# Altium schematic sheet watch.SchDoc
size A3
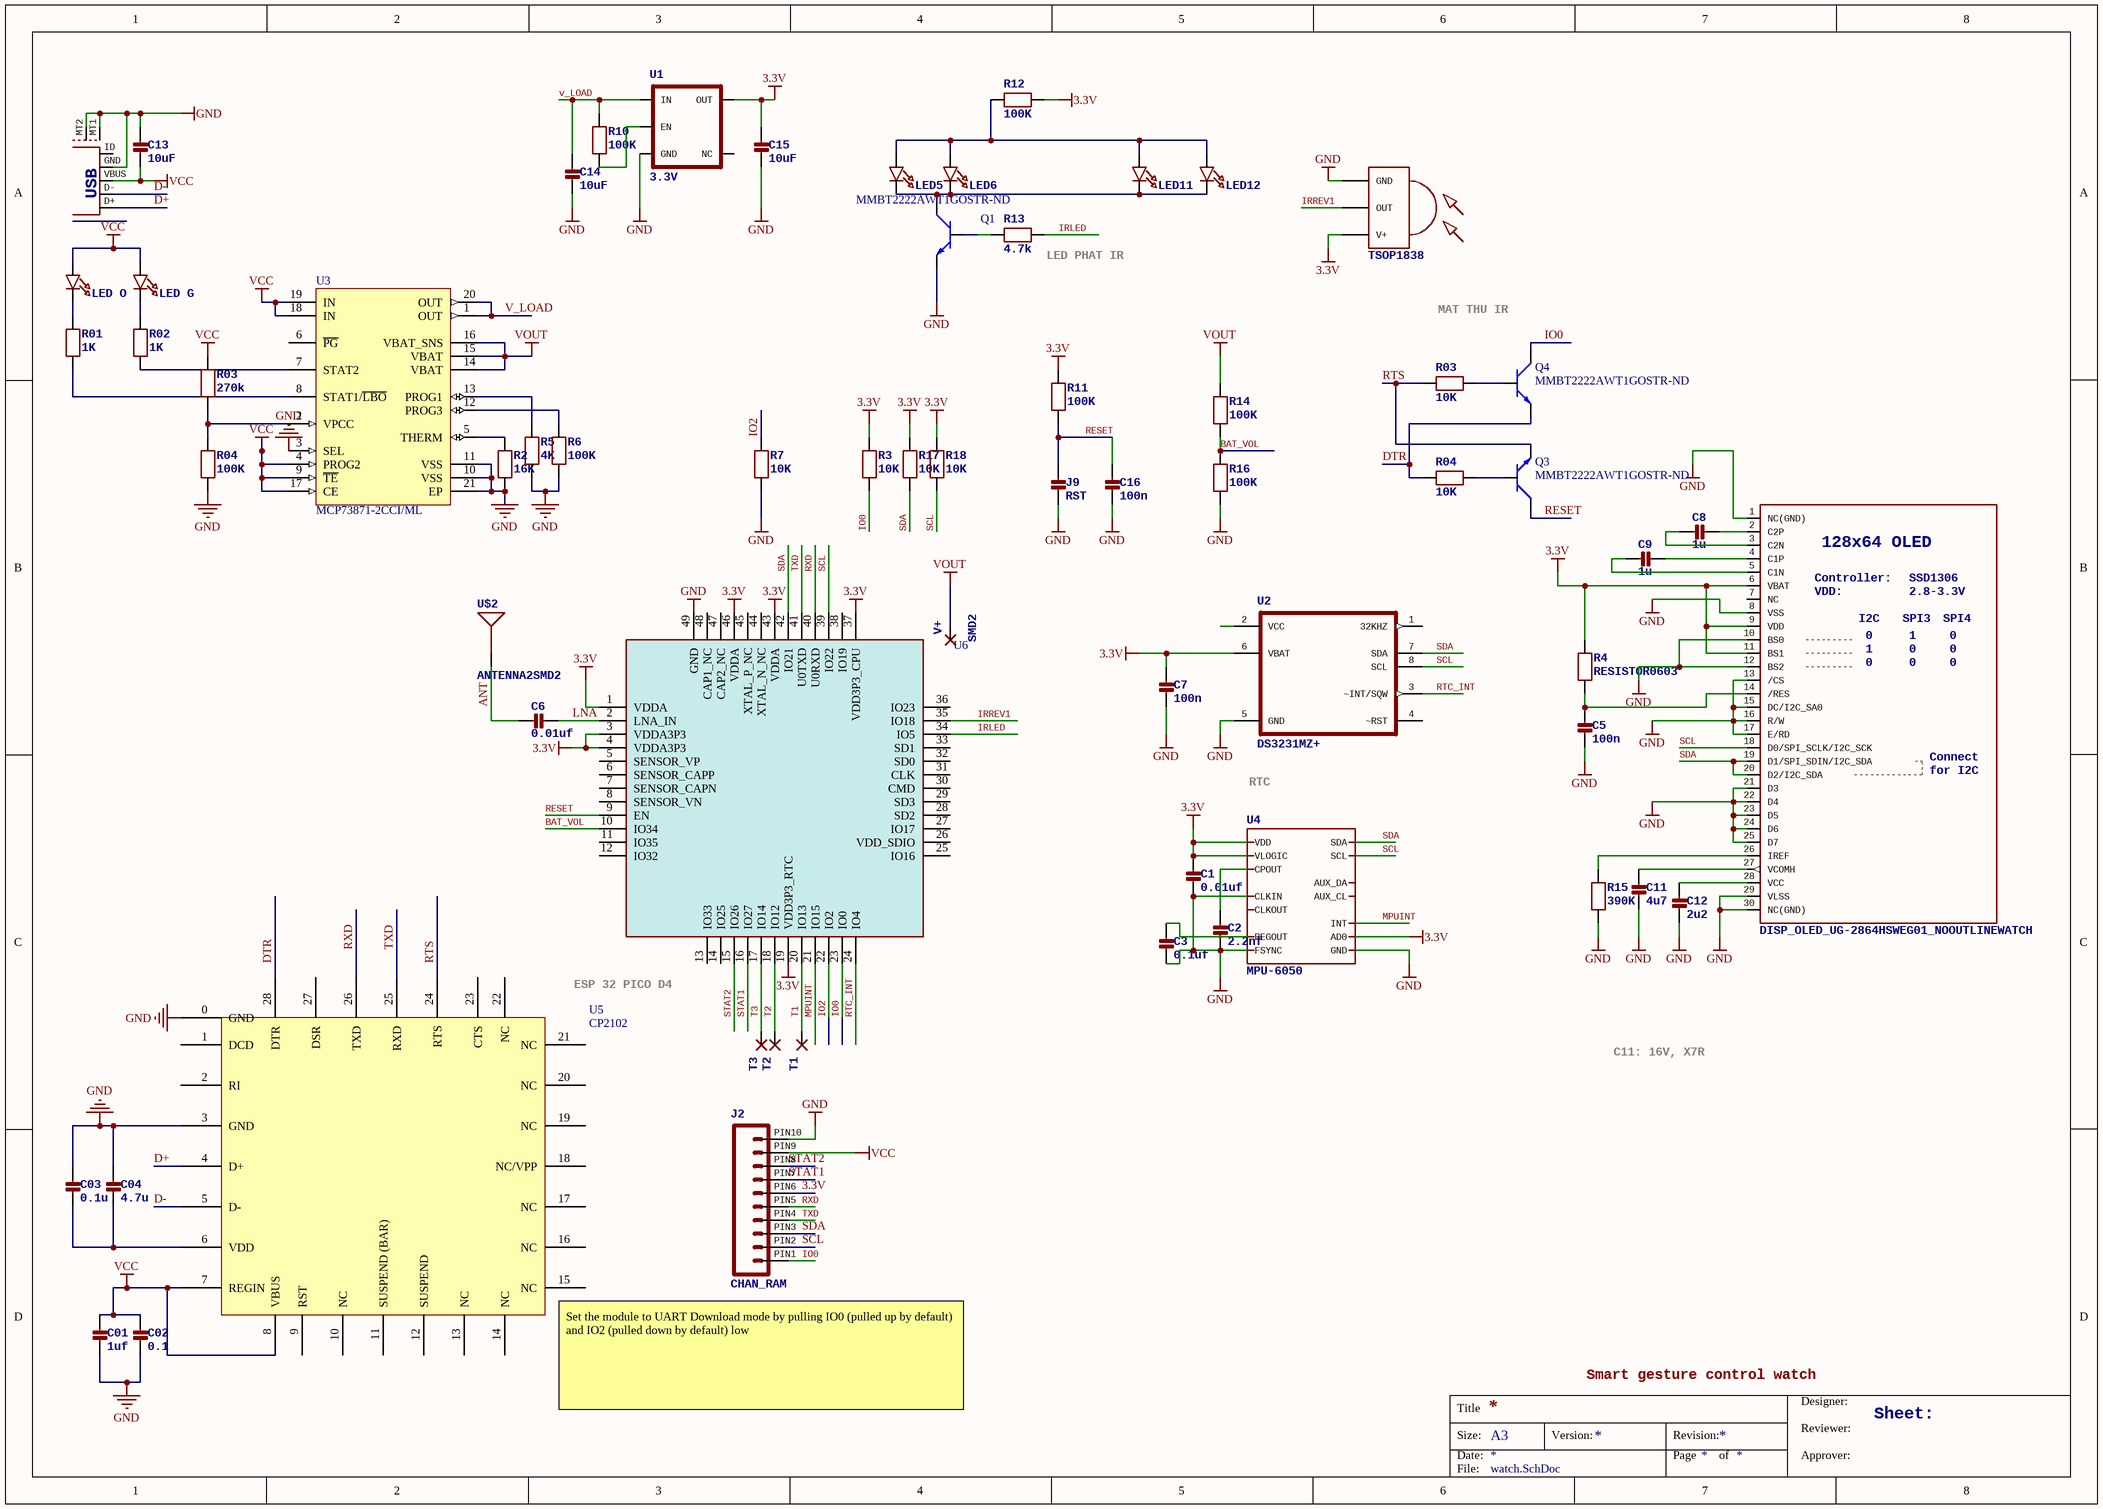
[diagram p0: watch.SchDoc]

## Parts
(Parts that share a designator on the sheet are numbered #1, #2 ... from top to bottom, then left to right.)
C1  0.01uf  [0603]
C01  1uf  [0603]
C2  2.2nf  [0603]
C02  0.1  [0603]
C3  0.1uf  [0603]
C03  0.1u  [0603]
C04  4.7u  [0603]
C5  100n  [0603]
C6  0.01uf  [0603]
C7  100n  [0603]
C8  1u  [0603]
C9  1u  [0603]
C11  4u7  [0603]
C12  2u2  [0603]
C13  10uF  [0603]
C14  10uF  [0603]
C15  10uF  [0603]
C16  100n  [0603]
J2  CHAN_RAM  [CHAN_RAM]
J9  RST  [0603]
LED5  LED0805  [CHIPLED_0805]  (value not drawn)
LED6  LED0805  [CHIPLED_0805]  (value not drawn)
LED11  LED0805  [CHIPLED_0805]  (value not drawn)
LED12  LED0805  [CHIPLED_0805]  (value not drawn)
LED_G  LED0805  [CHIPLED_0805]  (value not drawn)
LED_O  LED0805  [CHIPLED_0805]  (value not drawn)
OLED1  DISP_OLED_UG-2864HSWEG01_NOOUTLINEWATCH  128x64OLED: 128x64 OLED  forI2C: for I2C  Controller: Controller:  VDD: VDD:  [UG-2864HSWEG01_1.3_WRAPAROUND_WATCH]
Q1  Supplier Part Number 1: MMBT2222AWT1GOSTR-ND  [SOT-323]  (hidden comment: MMBT2222A)
Q3  Supplier Part Number 1: MMBT2222AWT1GOSTR-ND  [SOT-323]  (hidden comment: MMBT2222A)
Q4  Supplier Part Number 1: MMBT2222AWT1GOSTR-ND  [SOT-323]  (hidden comment: MMBT2222A)
R01  1K  [0603]
R2  16K  [0603]
R02  1K  [0603]
R3  10K  [0603]
R03#1  270k  [0603]
R03#2  10K  [0603]
R4  RESISTOR0603  [0603]
R04#1  100K  [0603]
R04#2  10K  [0603]
R5  4K  [0603]
R6  100K  [0603]
R7  10K  [0603]
R10  100K  [0603]
R11  100K  [0603]
R12  100K  [0603]
R13  4.7k  [0603]
R14  100K  [0603]
R15  390K  [0603]
R16  100K  [0603]
R17  10K  [0603]
R18  10K  [0603]
T1  SMD2  [SMD1,27-2,54]  (value not drawn)
T2  SMD2  [SMD1,27-2,54]  (value not drawn)
T3  SMD2  [SMD1,27-2,54]  (value not drawn)
U1  3.3V  [SOT23-5]
U2  DS3231MZ+  [SOIC8_150MIL_SMPAD]
U3  MCP73871-2CCI/ML  [QFN-ML20_N]
U4  MPU-6050  [QFN.24.4X4]
U5  CP2102  [CP2102]
U6  ESP32-PICO-D4  [PQFN50P700X700X100_HS-49N]  (value not drawn)
U$2  ANTENNA2SMD2  [ANTENNA-CHIP3]
U$4  TSOP1838  [TSOP18XX]
USB1  USB-MICROBLARGEPAD  [USB-MICROB_LARGEPAD]  (value not drawn)
V+  SMD2  [SMD1,27-2,54]

## Nets
3.3V: C1.2(P$2) C7.1(P$1) C15.1(P$1) J2.PIN6 OLED1.6(VBAT) OLED1.9(VDD) OLED1.11(BS1) R3.1 R4.2 R11.2 R12.1 R17.1 R18.1 U1.5(OUT) U2.6(VBAT) U4.8(VLOGIC) U4.9(AD0) U4.13(VDD) U6.1(VDDA) U6.3(VDDA3P3) U6.4(VDDA3P3) U6.19(VDD3P3_RTC) U6.37(VDD3P3_CPU) U6.43(VDDA) U6.46(VDDA) U$4.VCC(V+)
GND: C1.1(P$1) C01.2(P$2) C2.2(P$2) C02.2(P$2) C3.1(P$1) C03.1(P$1) C04.1(P$1) C5.2(P$2) C7.2(P$2) C11.2(P$2) C12.2(P$2) C13.1(P$1) C14.2(P$2) C15.2(P$2) C16.2(P$2) J2.PIN10 J9.2(P$2) OLED1.1(NC(GND)) OLED1.8(VSS) OLED1.10(BS0) OLED1.12(BS2) OLED1.13(/CS) OLED1.15(DC/I2C_SA0) OLED1.16(R/W) OLED1.17(E/RD) OLED1.21(D3) OLED1.22(D4) OLED1.23(D5) OLED1.24(D6) OLED1.25(D7) OLED1.29(VLSS) OLED1.30(NC(GND)) Q1.2(E) R2.2 R04#1.2 R5.2 R6.2 R7.2 R15.1 R16.2 U1.2(GND) U2.5(GND) U3.3(SEL) U3.10(VSS) U3.11(VSS) U3.21(EP) U4.1(CLKIN) U4.11(FSYNC) U4.18(GND) U5.0(GND) U5.3(GND) U6.49(GND) U$4.GND USB1.GND USB1.MT1(SHEILD1) USB1.MT2(SHEILD2)
VCC: C01.1(P$1) C02.1(P$1) C13.2(P$2) J2.PIN9 LED_G.1(A) LED_O.1(A) R03#1.1 U3.4(PROG2) U3.9(~{TE}) U3.17(CE) U3.18(IN) U3.19(IN) U5.7(REGIN) U5.8(VBUS) USB1.VBUS
VOUT: R14.1 U3.14(VBAT) U3.15(VBAT) U3.16(VBAT_SNS) V+.1(P)
ANT: C6.1(P$1) U$2.FEED(SIGNAL)
BAT_VOL: R14.2 R16.1 U6.10(IO34)
D+: U5.4(D+) USB1.D+
D-: U5.5(D-) USB1.D-
DTR: Q4.2(E) R04#2.1 U5.28(DTR)
IO0: J2.PIN1 Q4.3(C) R3.2 U6.23(IO0)
IO2: R7.1 U6.22(IO2)
IRLED: R13.1 U6.34(IO5)
IRREV1: U6.35(IO18) U$4.OUT
LNA: C6.2(P$2) U6.2(LNA_IN)
MPUINT: U4.12(INT) U6.21(IO15)
RESET: C16.1(P$1) J9.1(P$1) Q3.3(C) R11.1 U6.9(EN)
RTC_INT: U2.3(~INT/SQW) U6.24(IO4)
RTS: Q3.2(E) R03#2.2 U5.24(RTS)
RXD: J2.PIN5 U5.26(TXD) U6.40(U0RXD)
SCL: J2.PIN2 OLED1.18(D0/SPI_SCLK/I2C_SCK) R18.2 U2.8(SCL) U4.23(SCL) U6.39(IO22)
SDA: J2.PIN3 OLED1.19(D1/SPI_SDIN/I2C_SDA) OLED1.20(D2/I2C_SDA) R17.2 U2.7(SDA) U4.24(SDA) U6.42(IO21)
STAT1: J2.PIN7 U6.16(IO27)
STAT2: J2.PIN8 U6.15(IO26)
T1: T1.1(P) U6.20(IO13)
T2: T2.1(P) U6.18(IO12)
T3: T3.1(P) U6.17(IO14)
TXD: J2.PIN4 U5.25(RXD) U6.41(U0TXD)
v_LOAD: C14.1(P$1) R10.2 U1.1(IN) U3.1(OUT) U3.20(OUT)
NetC2_1: C2.1(P$1) U4.20(CPOUT)
NetC3_2: C3.2(P$2) U4.10(REGOUT)
NetC03_2: C03.2(P$2) C04.2(P$2) U5.6(VDD)
NetC5_1: C5.1(P$1) OLED1.14(/RES) R4.1
NetC8_1: C8.1(P$1) OLED1.3(C2N)
NetC8_2: C8.2(P$2) OLED1.2(C2P)
NetC9_1: C9.1(P$1) OLED1.5(C1N)
NetC9_2: C9.2(P$2) OLED1.4(C1P)
NetC11_1: C11.1(P$1) OLED1.27(VCOMH)
NetC12_1: C12.1(P$1) OLED1.28(VCC)
NetLED5_1: LED5.1(A) LED6.1(A) LED11.1(A) LED12.1(A) R12.2
NetLED5_2: LED5.2(C) LED6.2(C) LED11.2(C) LED12.2(C) Q1.3(C)
NetLED_G_2: LED_G.2(C) R02.1
NetLED_O_2: LED_O.2(C) R01.1
NetOLED1_26: OLED1.26(IREF) R15.2
NetQ1_1: Q1.1(B) R13.2
NetQ3_1: Q3.1(B) R04#2.2
NetQ4_1: Q4.1(B) R03#2.1
NetR01_2: R01.2 U3.8(STAT1/~{LBO})
NetR2_1: R2.1 U3.5(THERM)
NetR02_2: R02.2 U3.7(STAT2)
NetR03#1_2: R03#1.2 R04#1.1 U3.2(VPCC)
NetR5_1: R5.1 U3.13(PROG1)
NetR6_1: R6.1 U3.12(PROG3)
NetR10_1: R10.1 U1.3(EN)

Not connected (* = marked no-connect by the designer): OLED1 7(NC); U1 4(NC); U2 1(32KHZ) 2(VCC) 4(~RST); U3 6(~{PG}); U4 6(AUX_DA) 7(AUX_CL) 22(CLKOUT); U5 1(DCD) 2(RI) 9(RST) 10(NC) 11(SUSPEND_(BAR)) 12(SUSPEND) 13(NC) 14(NC) 15(NC) 16(NC) 17(NC) 18(NC/VPP) 19(NC) 20(NC) 21(NC) 22(NC) 23(CTS) 27(DSR); U6 5(SENSOR_VP) 6(SENSOR_CAPP) 7(SENSOR_CAPN) 8(SENSOR_VN) 11(IO35) 12(IO32) 13(IO33) 14(IO25) 25(IO16) 26(VDD_SDIO) 27(IO17) 28(SD2) 29(SD3) 30(CMD) 31(CLK) 32(SD0) 33(SD1) 36(IO23) 38(IO19) 44(XTAL_N_NC) 45(XTAL_P_NC) 47(CAP2_NC) 48(CAP1_NC); USB1 ID

## Notes on the sheet
- (near R13) LED PHAT IR
- MAT THU IR
- RTC
- ESP 32 PICO D4
- C11: 16V, X7R
- Smart gesture control watch
- (near U5) Set the module to UART Download mode by pulling IO0 (pulled up by default) and IO2 (pulled down by default) low
- Sheet:
- Title
- Size:
- Date:
- A3
- Version:
- Revision:
- Page
- of
- Designer:
- Reviewer:
- Approver:
- File:

## Library data of the parts
C1 C01 C2 C02 C3 C03 C04-C9 C11-C16 J9 = CAP_CERAMIC0603: Ceramic Capacitors0402 - 0402 Surface Mount Capacitors  16pF 50V 5% [Digikey: 445-4899-2-ND]  18pF 50V 5% [Digikey: 490-1281-2-ND]  22pF 50V 5% [Digikey: 490-1283-2-ND]  68pF 50V 5% [Digikey: 490-1289-2-ND]  0.1uF 10V 10% [Digikey: 490-1318-2-ND]  1.0uF 6.3V 10% [Digikey: 490-1320-2-ND]    0603 - 0603 Surface Mount Capacitors  16 pF 50V 5% [Digikey: 445-5051-2-ND]  22 pF 50V [Digikey: PCC220ACVTR-ND]  33 pF 50V 5% [Digikey: 490-1415-1-ND]  56pF 50V 5% [Digikey: 490-1421-1-ND]  220pF 50V 5% [Digikey: 445-1285-1-ND]  680 pF 50V   2200 pF 50V 5% C0G [Digikey: 445-1297-1-ND]  5600 pF 100V 5% X7R [Digikey: 478-3711-1-ND]  0.1 µF 25V 10% [Digikey: PCC2277TR-ND]  0.22 µF 16V 10% X7R [Digikey: 445-1318-1-ND]  1.0 µF 25V 10% [Digikey: 445-5146-2-ND]    0603 - RF Specific  3pF 250V +/-0.1pF RF [Digikey: 712-1347-1-ND]  18 pF 250V 5%  [Digikey: 478-3505-1-ND or 712-1322-1-ND]  56 pF 250V 5% C0G RF [Digikey: 490-4867-1-ND]  68 pF 250V RF [Digikey: 490-4868-1-ND]    0805 - 0805 Surface Mount Capacitors  220 pF 250V 2% RF Ceramic Capacitor [Digikey: 712-1398-1-ND]  1000 pF 50V 2% NP0 Ceramic Capacitor [Digikey: 478-3760-1-ND]  0.1 µF 25V 10% Ceramic Capacitor [Digikey: PCC1828TR-ND]  1.0 µF 16V 10% Ceramic Capacitor[Digikey: 490-1691-2-ND]  10.0 µF 10V 10% Ceramic Capacitor[Digikey: 709-1228-1-ND]  10.0 uF 16V 10% Ceramic Capacitor [Digikey: 478-5165-2-ND]  47 uF 6.3V 20% Ceramic Capacitor [Digikey: 587-1779-1-ND or 399-5506-1-ND]       1206 - 1206 Surface Mount Capacitors  47uF 10V 20% Ceramic Capacitor [Digikey: 490-5528-1-ND or 399-5508-1-ND or 445-6010-1-ND]  100uF 6.3V -20%, +80% Y5V Ceramic Capacitor (Digikey: 490-4512-1-ND, Mouser: 81-GRM31CF50J107ZE1L)
LED5 LED6 LED11 LED12 LED_G LED_O = LED0805: LED0603 - 0603 Surface Mount Package    2mA: Green LED - Low Power (3.9mcd, 2ma, 1.7Vf) - Digikey: 475-2709-2-ND  Orange LED - Low Power (9.8mcd, 2ma, 1.8Vf) - Digikey: 475-1194-2-ND  Red LED - Low Power (5mcd, 2ma, 1.8Vf) - Digikey: 475-1195-2-ND  Yellow LED - Low Power (7mcd, 2ma, 1.8Vf) - Digikey: 475-1196-2-ND       5mA: Blue LED - Low Power (17mcd, 5ma, 2.9Vf) - Digikey: LNJ937W8CRACT-ND    0805 - 0805 Surface Mount Package    2mA: Red LED (8.8mcd, 2mA, 1.8Vf, Clear) - Low Power [Digikey: 475-2510-1-ND]  Green LED (5mcd, 2mA, 1.8Vf, Clear) - Low Power [Digikey: 475-2730-1-ND]  Yellow LED (11.3mcd, 2mA, 1.8Vf, Clear) - Low Power [Digikey: 475-2555-1-ND]       20mA: Red LED (104mcd, 20mA, Diffused) - LS R976 [Digikey: 475-1278-6-ND]  Red LED (12mcd, 20mA, 2.0Vf, Clear) - APT2012EC [Digikey: 754-1128-1-ND]  Green LED (15mcd, 20mA, 2.2Vf, Clear) - APT2012GC [Digikey: 754-1131-1-ND]  Orange LED (160mcd, 20mA, 2.1Vf, Clear) - APT2012SECK [Digikey: 754-1130-1-ND]     1206 - 1206 Surface Mount Package  Green LED (26mcd, 20mA, Diffused) - LG N971  [Digikey: 475-1407-6-ND]  Red LED (15mcd, 20mA, Diffused) - LH N974 [Digikey: 475-1416-6-ND]
Q1 Q3 Q4 = MMBT2222A: NPN switching transistor  40V 600mA SOT23; Manufacturer: ON Semiconductor; Manufacturer Part Number: MMBT2222AWT1G; Vce Saturation (Max) @ Ib, Ic: 1V @ 50mA, 500mA; DC Current Gain (hFE) (Min) @ Ic, Vce: 100 @ 150mA, 10V; Frequency - Transition: 300MHz; Supplier 1: Digi-Key; RoHS: RoHS Compliant; Category: Discrete Semiconductor Products; Stock 1: 36000; Pricing 1: 3000=0.02383, 6000=0.02149, 15000=0.01869, 30000=0.01682, 75000=0.01495, 150000=0.01246 (USD); Packaging: Tape & Reel (TR); Part Status: Active; Transistor Type: NPN; Current - Collector Cutoff (Max): -; Operating Temperature: -55°C ~ 150°C (TJ); Mounting Type: Surface Mount; Package / Case: SC-70, SOT-323; Supplier Device Package: SC-70-3 (SOT323); Base Part Number: MMBT2222A; ComponentLink1URL: http://www.onsemi.com/pub/Collateral/MMBT2222AWT1-D.PDF; ComponentLink1Description: http://www.onsemi.com/pub/Collateral/MMBT2222AWT1-D.PDF
R01 R2 R02 R3 R03#1 R03#2 R4 R04#1 R04#2 R5-R7 R10-R18 = RESISTOR0603: Resistors0402 - 0402 Surface Mount Package  22 Ohm 1% 1/16W [Digikey: 311-22.0LRTR-ND]  33 Ohm 5% 1/16W  1.0K 5% 1/16W  1.5K 5% 1/16W  2.0K 1% 1/16W  10.0K 1% 1/16W [Digikey: 311-10.0KLRTR-ND]  10.0K 5% 1/16W [Digikey: RMCF0402JT10K0TR-ND]  12.1K 1% 1/16W [Digikey: 311-22.0LRTR-ND]  100.0K 5% 1/16W    0603 - 0603 Surface Mount Package  0 Ohm 1/10 Watt 1% Resistor  15 Ohm 1/10 Watt 1% Resistor  33 Ohm 1/10 Watt 1% Resistor  49.9 Ohm 1/10 Watt 1% Resistor  100 Ohm 1/10 Watt 1% Resistor  150 Ohm 1/10 Watt 1% Resistor  240 Ohm 1/10 Watt 1% Resistor  390 Ohm 1/10 Watt 1% Resistor  560 Ohm 1/10 Watt 1% Resistor  680 Ohm 1/10 Watt 1% Resistor  750 Ohm 1/10 Watt 1% Resistor  1.0K Ohm 1/10 Watt 1% Resistor  1.5K Ohm 1/10 Watt 1% Resistor  2.0K Ohm 1/10 Watt 1% Resistor  2.2K Ohm 1/10 Watt 1% Resistor  3.3K Ohm 1/10 Watt 1% Resistor  4.7K Ohm 1/10 Watt 1% Resistor  10.0K Ohm 1/10 Watt 1% Resistor  12.0K Ohm 1/10 Watt 1% Resistor  12.1K Ohm 1/10 Watt 1% Resistor  20.0K Ohm 1/10 Watt 1% Resistor  33.0K Ohm 1/10 Watt 1% Resistor  100.0K Ohm 1/10 Watt 1% Resistor    0805 - 0805 Surface Mount Package  0 Ohm 1/8 Watt 1% Resistor  33 Ohm 1/8 Watt 1% Resistor  100 Ohm 1/8 Watt 1% Resistor  150 Ohm 1/8 Watt 1% Resistor  200 Ohm 1/8 Watt 1% Resistor  240 Ohm 1/8 Watt 1% Resistor  330 Ohm 1/8 Watt 1% Resistor  390 Ohm 1/8 Watt 1% Resistor  470 Ohm 1/8 Watt 1% Resistor  1.0K Ohm 1/8 Watt 1% Resistor  1.5K Ohm 1/8 Watt 1% Resistor  2.0K Ohm 1/8 Watt 1% Resistor  4.7K Ohm 1/8 Watt 1% Resistor  5.1K Ohm 1/8 Watt 1% Resistor  5.6K Ohm 1/8 Watt 1% Resistor  10.0K Ohm 1/8 Watt 1% Resistor  22.0K Ohm 1/8 Watt 1% Resistor  33.0K Ohm 1/8 Watt 1% Resistor  100K Ohm 1/8 Watt 1% Resistor    1206 - 1206 Surface Mount Package  2012 - 2010 Surface Mount Package  0.11 Ohm 1/2 Watt 1% Resistor - Digikey: RHM.11UCT-ND
T1-T3 V+ = SMD2: SMD PAD
U1 = V_REG_AP2112K-3.3V: AP2112 - 600mA CMOS LDO Regulator w/ Enable    The AP2112 is CMOS process low dropout linear regulator with enable function, the regulator delivers a guaranteed 600mA (min.) continuous load current.   Features  Output Voltage Accuracy: ±1.5%   Output Current: 600mA (Min.)   Foldback Short Current Protection: 50mA   Enable Function to Turn ON/OFF VOUT  Low Dropout Voltage (3.3V): 250mV (Typ.) @IOUT=600mA   Excellent Load Regulation: 0.2%/A (Typ.)   Excellent Line Regulation: 0.02%/V (Typ.)   Low Quiescent Current: 55μA (Typ.)  Low Standby Current: 0.01μA (Typ.)  Low Output Noise: 50μVRMS   PSRR: 100Hz -65dB, 1kHz -65dB    OTSD Protection   Stable  with  1.0μF Flexible Cap: Ceramic, Tantalum and Aluminum Electrolytic   Operation Temperature Range: -40°C to 85°C   ESD: MM 400V, HBM 4000V; PROD_ID: VREG-12457; VALUE: 3.3V
U2 = DS3231MZ+SMPAD
U3 = MCP73871-2CCI/ML: Stand-Alone System Load Sharing and Li-Ion/Li-Polymer Battery Charge Management Controller, 4.2V, 20-Pin QFN, Industrial Temperature; Manufacturer: Microchip; DatasheetVersion: revB, May-2009; PackageVersion: revBB, Aug-2009; PackageReference: QFN-ML20; PackageDescription: 20-Lead Plastic Quad Flat, No Lead Package (ML) - 4x4x0.9 mm Body [QFN]; Supplier 1: Digi-Key; Supplier Part Number 1: MCP73871-2CCI/ML-ND; Supplier 2: Farnell; Supplier Part Number 2: 1642489; Supplier 3: Newark; Supplier Part Number 3: 54M4957; Supplier 4: Mouser; Supplier Part Number 4: 579-MCP73871-2CCI/ML; Mounting Technology: Surface Mount; PartNumber: MCP73871-2CCI/ML; ComponentLink1Description: Manufacturer URL; ComponentLink1URL: http://www.microchip.com/; ComponentLink2Description: Datasheet; ComponentLink2URL: http://ww1.microchip.com/downloads/en/DeviceDoc/22090b.pdf; ComponentLink3Description: Package Specification; ComponentLink3URL: http://www.microchip.com/stellent/groups/techpub_sg/documents/packagingspec/en012702.pdf
U$2 = ANTENNA2SMD2: Chip antenna   Single endded antenna. Common with smaller chip antennas. CHIP4 package is the GPS Chip Antenna SKU: GPS-08418. CHIP5 package is 2.4GHz chip antenna SKU: WRL-00144.
U$4 = TSOP1838: IR Receiver and Demodulator
OLED1 = DISP_OLED_UG-2864HSWEG01_NOOUTLINEWATCH: I2C: I2C; SPI3: SPI3; 0: 0; 1: 1; Connect: Connect; SSD1306: SSD1306; 2.8-3.3V: 2.8-3.3V; SPI4: SPI4
USB1 = USB-MICROBLARGEPAD: USB: USB